# Altium schematic sheet RTC-IMU Sensor.SchDoc
size A; SheetNumber: 2; SheetTotal: 2
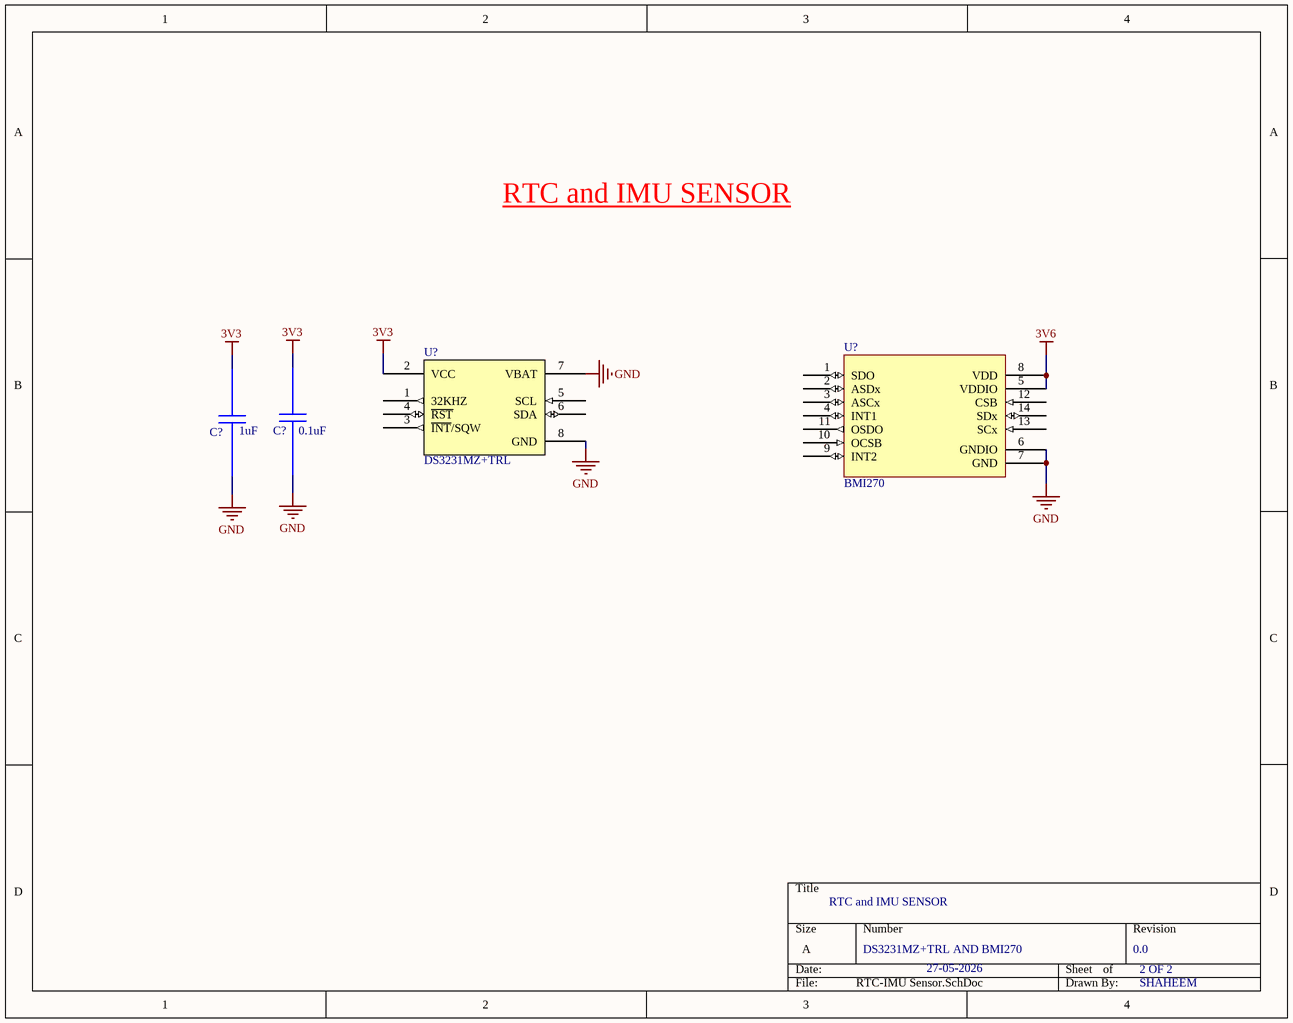
[diagram p0: RTC-IMU Sensor.SchDoc]

## Parts
(Parts that share a designator on the sheet are numbered #1, #2 ... from top to bottom, then left to right.)
C?#1  1uF
C?#2  0.1uF
U?#1  DS3231MZ+TRL  [DS3231MZ+TRL]
U?#2  BMI270

## Nets
3V3: U?#1.2(VCC)
3V6: U?#2.5(VDDIO) U?#2.8(VDD)
GND: U?#1.7(VBAT) U?#1.8(GND) U?#2.6(GNDIO) U?#2.7(GND)

Not connected (* = marked no-connect by the designer): U?#1 1(32KHZ) 3(~{INT}/SQW) 4(~{RST}) 5(SCL) 6(SDA); U?#2 1(SDO) 2(ASDx) 3(ASCx) 4(INT1) 9(INT2) 10(OCSB) 11(OSDO) 12(CSB) 13(SCx) 14(SDx)

## Notes on the sheet
- RTC and IMU SENSOR
- DS3231MZ+TRL AND BMI270
- 27-05-2026
- 0.0
- 2 OF 2
- SHAHEEM

## Library data of the parts
C?#1 C?#2 = C0402C104K7PACTU: Multilayer Ceramic Capacitors MLCC - SMD/SMT V 0.1uF X5R 0402 10%; Manufacturer: Yageo Group; Value: 100nF; Voltage Rating (DC): 4V; Supplier: DigiKey; Supplier Part Number: 399-14871-2-ND; Manufacturer Part Number: C0402C104K7PACTU; RoHS: Compliant; Category: Ceramic Capacitors; Stock: 10000; Pricing: 10000=0.01597, 20000=0.01478, 30000=0.01419, 50000=0.01353, 70000=0.01314, 100000=0.01277 (USD); Case/Package: 0402; China RoHS: Compliant; Dielectric: X5R; Dielectric Material: Ceramic; Height: 500µm; Lead Free: Lead Free; Length: 1mm; Lifecycle Status: Production; Max Operating Temperature: 85°C; Min Operating Temperature: -55°C; Mounting Technology: Surface Mount; Number of Terminals: 2; REACH SVHC: Yes; Width: 500µm; ComponentLink1URL: https://datasheet.octopart.com:443/C0402C104K7PACTU-KEMET-datasheet-178499189.pdf?src-supplier=IHS; ComponentLink1Description: https://datasheet.octopart.com:443/C0402C104K7PACTU-KEMET-datasheet-178499189.pdf?src-supplier=IHS; ComponentLink2URL: https://datasheet.octopart.com:443/C0402C104K7PACTU-KEMET-datasheet-137357760.pdf?src-supplier=Ciiva; ComponentLink2Description: https://datasheet.octopart.com:443/C0402C104K7PACTU-KEMET-datasheet-137357760.pdf?src-supplier=Ciiva; ComponentLink3URL: https://datasheet.octopart.com/C0402C104K7PACTU-KEMET-datasheet-84169754.pdf; ComponentLink3Description: https://datasheet.octopart.com/C0402C104K7PACTU-KEMET-datasheet-84169754.pdf
U?#1 = DS3231MZ+TRL: HH: MM: SS (12/24 hr) 128bit 2.3V 5.5V 2, I2C, Serial YY-MM-DD-dd SOIC-8 4.9mm*3.9mm*1.55mm; Manufacturer: Analog Devices; Manufacturer Lifecycle Status: PRODUCTION; Evaluation Kit: Yes; Logic Function: Clock; Operating Supply Voltage: 3.3V; Supplier: DigiKey; Supplier Part Number: 175-DS3231MZ+TRLCT-ND; Manufacturer Part Number: DS3231MZ+TRL; RoHS: Compliant; Category: Real Time Clocks; Stock: 7705; Pricing: 1=12.68, 10=9.957, 25=9.276, 100=8.5273, 250=8.30792 (USD); Case/Package: SOIC; Date Format: YY-MM-DD-dd; Interface: I2C; Lifecycle Status: Production; Max Operating Temperature: 85°C; Max Supply Voltage: 5.5V; Min Operating Temperature: -40°C; Min Supply Voltage: 2.3V; Mounting Technology: Surface Mount; Pins: 8; Packaging: Cut Tape; Radiation Hardening: No; REACH SVHC: Unknown; Schedule B: 8542390000|8542390000|8542390000|8542390000|8542390000|8542390000|8542390000|8542390000|8542390000|8542390000|8542390000|8542390000|8542390000|8542390000|8542390000|8542390000|8542390000|8542390000|8542390000|8542390000|8542390000|8542390000|8542390000|85; Time Format: HH:MM:SS (12/24 hr); ComponentLink1URL: https://octopart.com:443/opatz8j6/c1?t=VpmGs2zHwq00Ntx8-C9ikKrWpdgI_6obw9CoEXSkQfdREDwHx9U4_Gh7PrT9ZclzUn_6m4Pq1M-zYGe6wzlePTrl1SA5bCeYFsLi9k-K_BN8OYMW1V0JtQDIT4kcriXfwGGCwrRzvenitp_dqb225p-6G8oayRpm4GU0Y1emu0mIW65C5DaZ3BrlAfRfm8GYpCnrXLEmJEQyHcmUiA5Nzy8W1LVFDt8vFz8EnY90IgRDBtZDdZYAoJkwvFxciAvjGNj82WUZkEsiDwp3uyAXezmSTtNEHurlSpsIVX-KT_RE3oaxApzkU4du&src-supplier=Analog+Devices; ComponentLink1Description: https://octopart.com:443/opatz8j6/c1?t=VpmGs2zHwq00Ntx8-C9ikKrWpdgI_6obw9CoEXSkQfdREDwHx9U4_Gh7PrT9ZclzUn_6m4Pq1M-zYGe6wzlePTrl1SA5bCeYFsLi9k-K_BN8OYMW1V0JtQDIT4kcriXfwGGCwrRzvenitp_dqb225p-6G8oayRpm4GU0Y1emu0mIW65C5DaZ3BrlAfRfm8GYpCnrXLEmJEQyHcmUiA5Nzy8W1LVFDt8vFz8EnY90IgRDBtZDdZYAoJkwvFxciAvjGNj82WUZkEsiDwp3uyAXezmSTtNEHurlSpsIVX-KT_RE3oaxApzkU4du&src-supplier=Analog+Devices; ComponentLink2URL: https://datasheet.octopart.com:443/DS3231MZ%2BTRL-Dallas-Semiconductor-datasheet-13717986.pdf?src-supplier=Upverter; ComponentLink2Description: https://datasheet.octopart.com:443/DS3231MZ%2BTRL-Dallas-Semiconductor-datasheet-13717986.pdf?src-supplier=Upverter; ComponentLink3URL: https://datasheet.octopart.com:443/DS3231MZ%2BTRL-Analog-Devices-datasheet-62054857.pdf?src-supplier=LKR; ComponentLink3Description: https://datasheet.octopart.com:443/DS3231MZ%2BTRL-Analog-Devices-datasheet-62054857.pdf?src-supplier=LKR; ComponentLink4URL: https://datasheet.octopart.com:443/DS3231MZ%2BTRL-Maxim-Integrated-datasheet-159004021.pdf?src-supplier=Augswan; ComponentLink4Description: https://datasheet.octopart.com:443/DS3231MZ%2BTRL-Maxim-Integrated-datasheet-159004021.pdf?src-supplier=Augswan; ComponentLink5URL: https://sigma.octopart.com:443/138901689/technical_drawing/Maxim-Integrated-DS3231MZ%2BTRL.pdf?src-supplier=ShanghaiCT; ComponentLink5Description: https://sigma.octopart.com:443/138901689/technical_drawing/Maxim-Integrated-DS3231MZ%2BTRL.pdf?src-supplier=ShanghaiCT; ComponentLink6URL: https://datasheet.octopart.com:443/DS3231MZ%2BTRL-Analog-Devices-datasheet-166785826.pdf?src-supplier=Arrow.cn; ComponentLink6Description: https://datasheet.octopart.com:443/DS3231MZ%2BTRL-Analog-Devices-datasheet-166785826.pdf?src-supplier=Arrow.cn; ComponentLink7URL: http://sigma.octopart.com:80/conflict_mineral_statement/Analog-Devices-company-33.pdf?src-supplier=Compliance+Statements; ComponentLink7Description: http://sigma.octopart.com:80/conflict_mineral_statement/Analog-Devices-company-33.pdf?src-supplier=Compliance+Statements; ComponentLink8URL: http://sigma.octopart.com:80/reach_statement/Maxim-Integrated-company-67.pdf?src-supplier=Compliance+Statements; ComponentLink8Description: http://sigma.octopart.com:80/reach_statement/Maxim-Integrated-company-67.pdf?src-supplier=Compliance+Statements; ComponentLink9URL: http://sigma.octopart.com:80/rohs_statement/Maxim-Integrated-company-66.pdf?src-supplier=Compliance+Statements; ComponentLink9Description: http://sigma.octopart.com:80/rohs_statement/Maxim-Integrated-company-66.pdf?src-supplier=Compliance+Statements; ComponentLink10URL: http://sigma.octopart.com:80/conflict_mineral_statement/Maxim-Integrated-company-65.pdf?src-supplier=Compliance+Statements; ComponentLink10Description: http://sigma.octopart.com:80/conflict_mineral_statement/Maxim-Integrated-company-65.pdf?src-supplier=Compliance+Statements; ComponentLink11URL: https://octopart.com:443/opatz8j6/c1?t=O5yJd09fH_J-1-J7Sjpa8Psl9IfGxqzvmNEaE2vPwhX6krYTaPsKy1I9KkoB9rQXM3SgCLlmT5oBDBDTtZyhc1zDcDlc1aOxnE-J_wpiOqBfEYX8hFHqevKl8r9cHCoiIfwjzic-VURDx0gva05Lx4T5lPzB5IyMiPK7VCdNa558j-X2-LK2SStKHL9eLNqHayqDB_DqUtRK2yiq7i0mpCoEpnrWYypUsYqiEmKKvm8wmW-gOpJaGYgu_xqw4hITAyiYAztRLK6WjjeTTyeJa0m7jXSyuC6BBjwj42qGAEDvqlS3XScScTCX&src-supplier=Compliance+Statements; ComponentLink11Description: https://octopart.com:443/opatz8j6/c1?t=O5yJd09fH_J-1-J7Sjpa8Psl9IfGxqzvmNEaE2vPwhX6krYTaPsKy1I9KkoB9rQXM3SgCLlmT5oBDBDTtZyhc1zDcDlc1aOxnE-J_wpiOqBfEYX8hFHqevKl8r9cHCoiIfwjzic-VURDx0gva05Lx4T5lPzB5IyMiPK7VCdNa558j-X2-LK2SStKHL9eLNqHayqDB_DqUtRK2yiq7i0mpCoEpnrWYypUsYqiEmKKvm8wmW-gOpJaGYgu_xqw4hITAyiYAztRLK6WjjeTTyeJa0m7jXSyuC6BBjwj42qGAEDvqlS3XScScTCX&src-supplier=Compliance+Statements
U?#2 = BMI270: LGA-14(2.5x3) Attitude Sensor/Gyroscope ROHS; Manufacturer: Bosch Tools; Supplier: DigiKey; Supplier Part Number: 828-1091-6-ND; Manufacturer Part Number: BMI270; RoHS: Compliant; Category: Sensors; Stock: 7097; Pricing: 1=4.23, 5=3.788, 10=3.624, 25=3.428, 50=3.2942, 100=3.1715, 500=2.92464, 1000=2.8327 (USD); Export Control Classification Number (ECCN) Code: EAR99; Introduction Date: 2019-05-31; Lifecycle Status: Production; REACH SVHC: Yes; ComponentLink1URL: https://datasheet.octopart.com:443/BMI270-Bosch-Tools-datasheet-181206537.pdf?src-supplier=IHS; ComponentLink1Description: https://datasheet.octopart.com:443/BMI270-Bosch-Tools-datasheet-181206537.pdf?src-supplier=IHS; ComponentLink2URL: https://datasheet.octopart.com:443/BMI270-Bosch-Tools-datasheet-136061757.pdf?src-supplier=Future+Electronics; ComponentLink2Description: https://datasheet.octopart.com:443/BMI270-Bosch-Tools-datasheet-136061757.pdf?src-supplier=Future+Electronics